# EAGLE design AM1027 POTS REV01 (EAGLE 6.6.0)
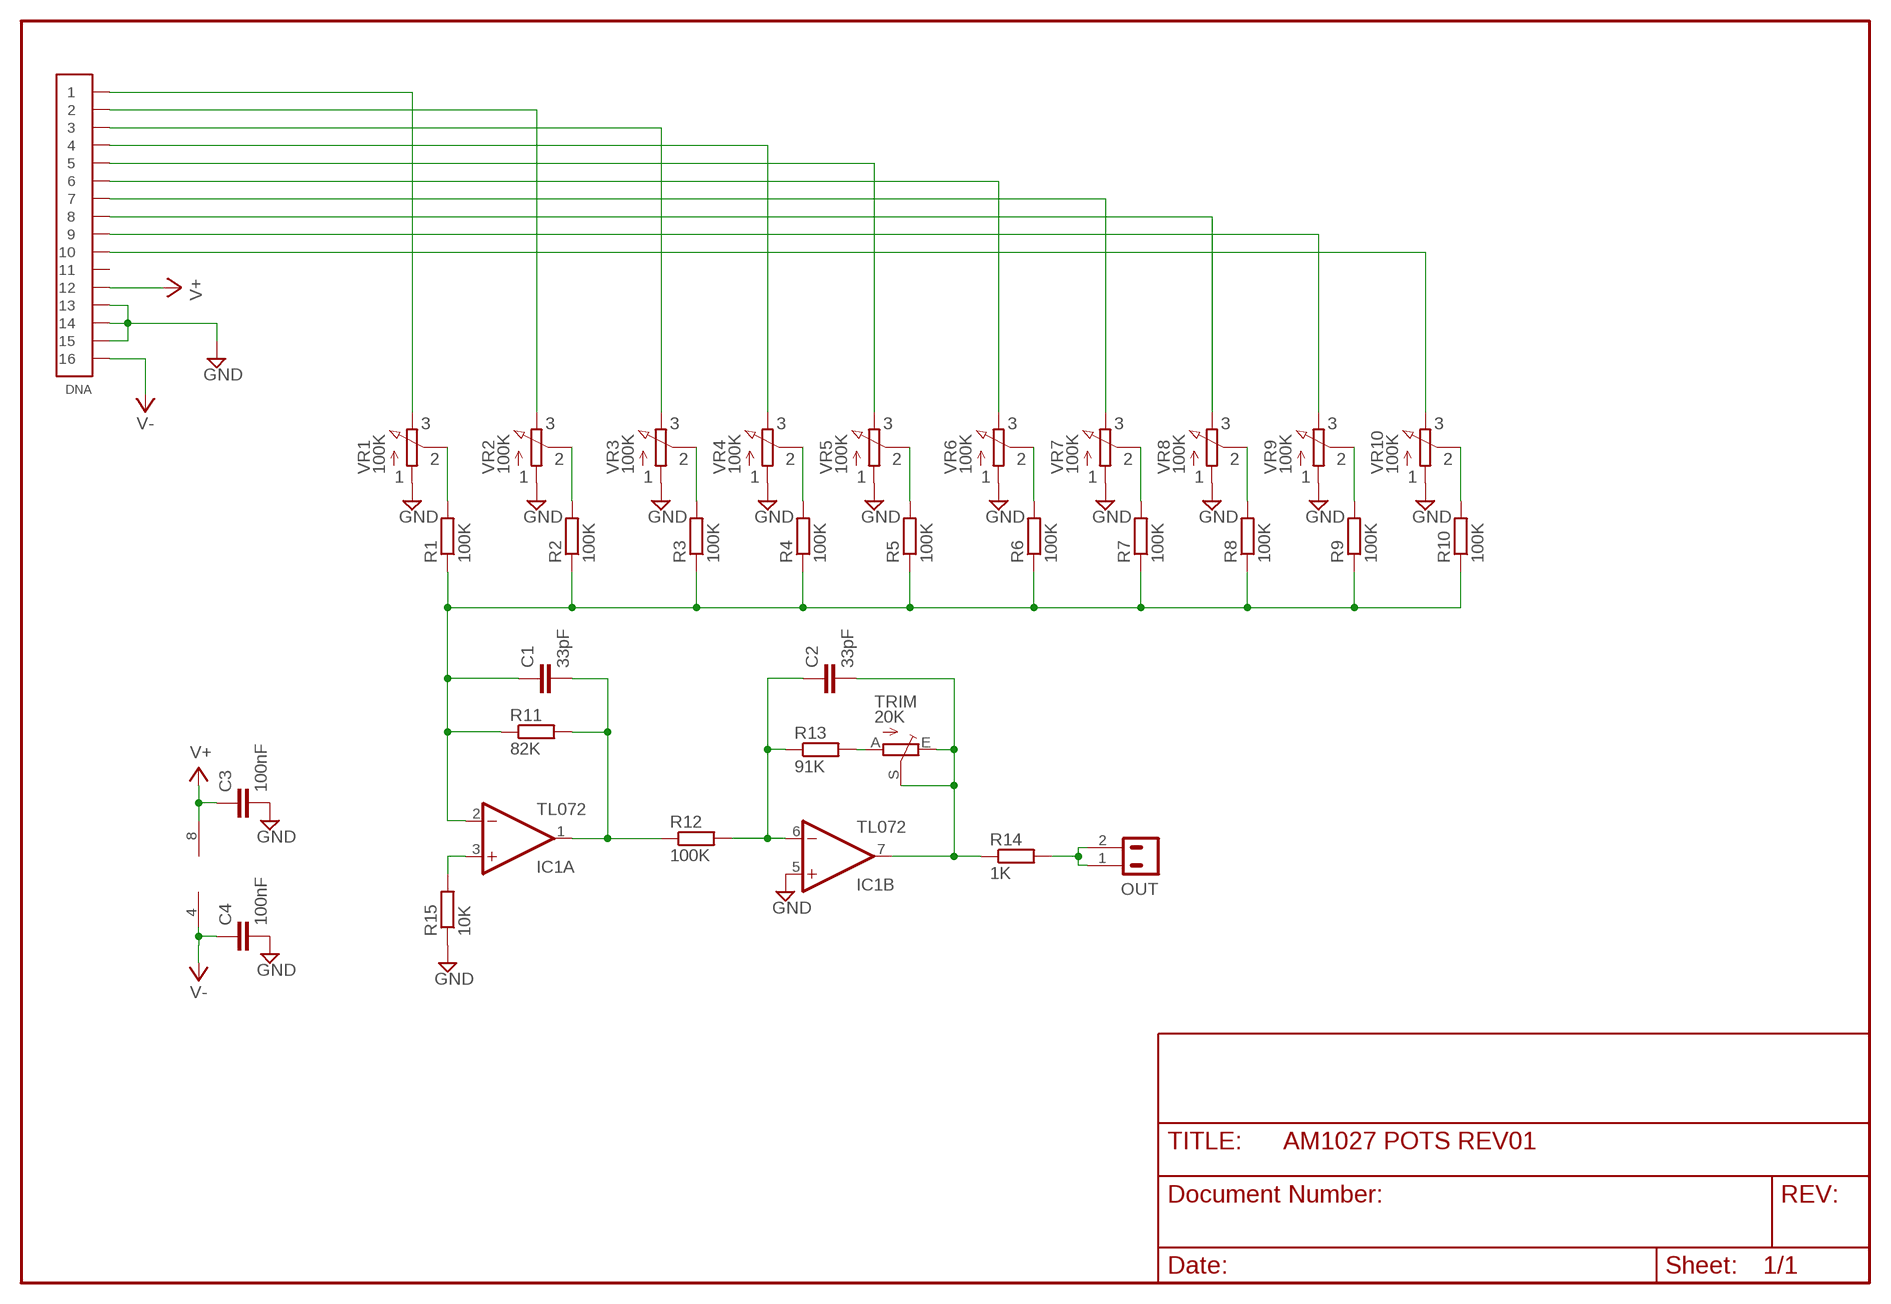
[diagram p0: schematic, sheet 1]

## Parts
C1  33pF  C-EU050-025X075AM  [C050-025X075AM]
C2  33pF  C-EU050-025X075AM  [C050-025X075AM]
C3  100nF  C-EU050-025X075AM  [C050-025X075AM]
C4  100nF  C-EU050-025X075AM  [C050-025X075AM]
DNA  AMPWR16PIN  [AMPWR16]
IC1  TL072  [DIL08AM]
OUT  MA02-AM  [MA02-AM]
R1  100K  R-EU_0207/10-AM  [0207/10/AM]
R2  100K  R-EU_0207/10-AM  [0207/10/AM]
R3  100K  R-EU_0207/10-AM  [0207/10/AM]
R4  100K  R-EU_0207/10-AM  [0207/10/AM]
R5  100K  R-EU_0207/10-AM  [0207/10/AM]
R6  100K  R-EU_0207/10-AM  [0207/10/AM]
R7  100K  R-EU_0207/10-AM  [0207/10/AM]
R8  100K  R-EU_0207/10-AM  [0207/10/AM]
R9  100K  R-EU_0207/10-AM  [0207/10/AM]
R10  100K  R-EU_0207/10-AM  [0207/10/AM]
R11  82K  R-EU_0207/10-AM  [0207/10/AM]
R12  100K  R-EU_0207/10-AM  [0207/10/AM]
R13  91K  R-EU_0207/10-AM  [0207/10/AM]
R14  1K  R-EU_0207/10-AM  [0207/10/AM]
R15  10K  R-EU_0207/10-AM  [0207/10/AM]
TRIM  20K  TRIM_EU-S64W  [S64W-AM]
VR1  100K  SPECTROL148  [SPECTROL148]
VR2  100K  SPECTROL148  [SPECTROL148]
VR3  100K  SPECTROL148  [SPECTROL148]
VR4  100K  SPECTROL148  [SPECTROL148]
VR5  100K  SPECTROL148  [SPECTROL148]
VR6  100K  SPECTROL148  [SPECTROL148]
VR7  100K  SPECTROL148  [SPECTROL148]
VR8  100K  SPECTROL148  [SPECTROL148]
VR9  100K  SPECTROL148  [SPECTROL148]
VR10  100K  SPECTROL148  [SPECTROL148]

## Nets
GND [POWER]: C3.P$4 C4.P$4 DNA.13 DNA.14 DNA.15 IC1.5(B:+IN) R15.P$1 VR1.P$1(A) VR2.P$1(A) VR3.P$1(A) VR4.P$1(A) VR5.P$1(A) VR6.P$1(A) VR7.P$1(A) VR8.P$1(A) VR9.P$1(A) VR10.P$1(A)
N$1: R1.P$2 VR1.P$2(S)
N$2: R2.P$2 VR2.P$2(S)
N$3: R3.P$2 VR3.P$2(S)
N$4: R4.P$2 VR4.P$2(S)
N$5: R5.P$2 VR5.P$2(S)
N$6: R6.P$2 VR6.P$2(S)
N$7: R7.P$2 VR7.P$2(S)
N$8: R8.P$2 VR8.P$2(S)
N$9: R9.P$2 VR9.P$2(S)
N$10: R10.P$2 VR10.P$2(S)
N$11: DNA.1 VR1.P$3(E)
N$12: DNA.2 VR2.P$3(E)
N$13: DNA.3 VR3.P$3(E)
N$14: DNA.4 VR4.P$3(E)
N$15: DNA.5 VR5.P$3(E)
N$16: DNA.6 VR6.P$3(E)
N$17: DNA.7 VR7.P$3(E)
N$18: DNA.8 VR8.P$3(E)
N$19: DNA.9 VR9.P$3(E)
N$20: DNA.10 VR10.P$3(E)
N$21: C1.P$3 IC1.2(A:-IN) R1.P$1 R2.P$1 R3.P$1 R4.P$1 R5.P$1 R6.P$1 R7.P$1 R8.P$1 R9.P$1 R10.P$1 R11.P$1
N$22: C2.P$4 IC1.7(B:OUT) R14.P$1 TRIM.E TRIM.S
N$23: C1.P$4 IC1.1(A:OUT) R11.P$2 R12.P$1
N$24: C2.P$3 IC1.6(B:-IN) R12.P$2 R13.P$1
N$25: IC1.3(A:+IN) R15.P$2
N$26: R13.P$2 TRIM.A
N$27: OUT.1 OUT.2 R14.P$2
V+ [POWER]: C3.P$3 DNA.12 IC1.8(P:V+)
V- [POWER]: C4.P$3 DNA.16 IC1.4(P:V-)
Unconnected: DNA.11

## Library data of the parts
C1-C4 = rcl:C-EU: CAPACITOR, European symbol
DNA = analog-metropolis:AMPWR16PIN: Doepfer 16 pin Power Supply Connector
IC1 = analog-metropolis:TL072: OP AMP
OUT = con-lstb:MA02-AM: 0.1" Pin Header - AM Style 1.0mm holes
R1-R15 = rcl:R-EU_: RESISTOR, European symbol
TRIM = pot:TRIM_EU-: POTENTIOMETER AM Style
VR1-VR10 = pot:SPECTROL148: SPECTROL 148 Potentiometer - AM style

## Net classes
0 default: width 0.381 mm, drill 0.7 mm, clearance 0.381 mm
1 POWER: width 0.635 mm, drill 0.7 mm, clearance 0.635 mm

## Board
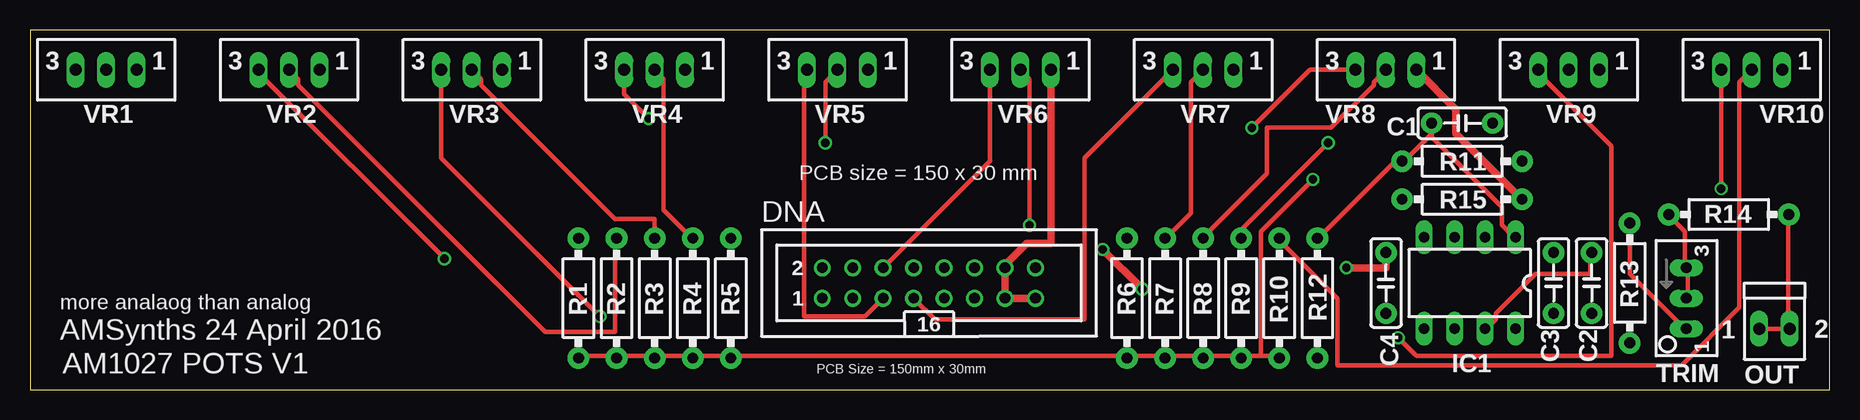
[diagram p1: board, top side]
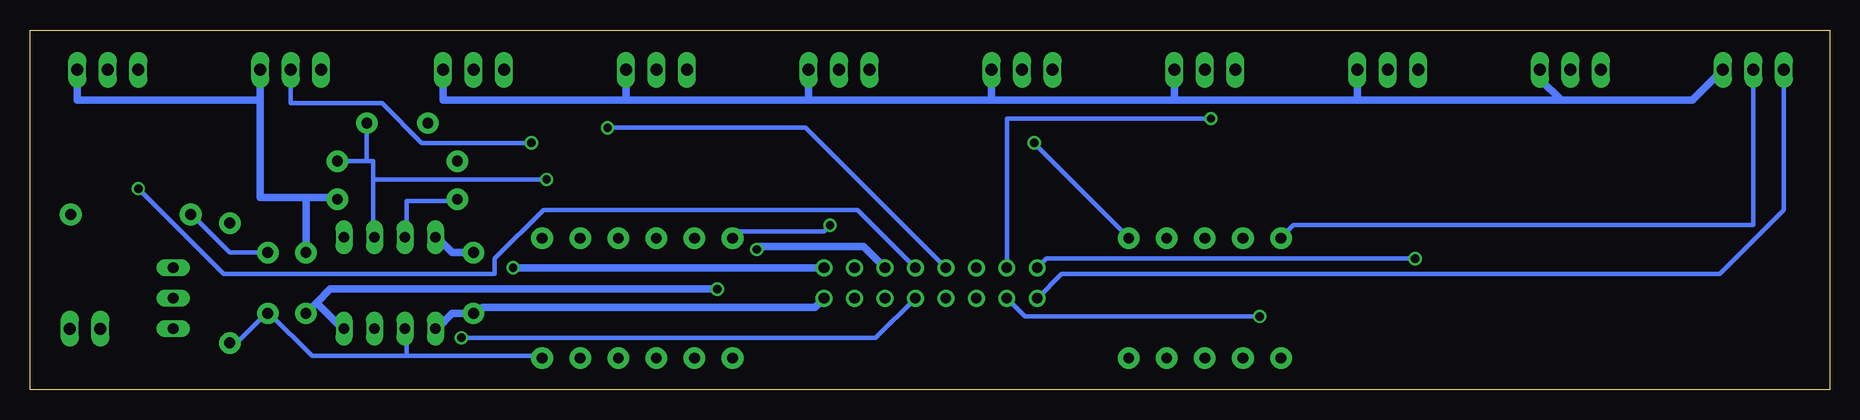
[diagram p2: board, bottom side, seen from below]

Size 150 x 30 mm. Coordinates in mm from the lower left corner, seen from the top.
Outline: 0,0 150,0 150,30 0,30 0,0
Copper layers (1*16): Top 0.035mm / dielectric 1.5mm / Bottom 0.035mm
Design rules "default": minimum track width 10mil, minimum drill 24mil, track to track 8mil, track to pad 8mil, pad to pad 8mil, via to via 8mil, smd to smd 8mil, copper to edge 40mil, drill to drill 8mil, minimum pad ring 10mil, minimum via ring 8mil, stop-mask expansion 4mil, vias tented up to drill 0mil, thermal gap 10mil

### Footprints (pad centres in the part's own frame; a part is rotated, then mirrored left to right if it is on the bottom)
C050-025X075AM = drill 0.9 pad 1.778: P$3 -2.54,0; P$4 2.54,0
AMPWR16 = drill 0.9: 1 -8.89,-1.27; 2 -8.89,1.27; 3 -6.35,-1.27; 4 -6.35,1.27; 5 -3.81,-1.27; 6 -3.81,1.27; 7 -1.27,-1.27; 8 -1.27,1.27; 9 1.27,-1.27; 10 1.27,1.27; 11 3.81,-1.27; 12 3.81,1.27; 13 6.35,-1.27; 14 6.35,1.27; 15 8.89,-1.27; 16 8.89,1.27
DIL08AM = drill 0.9 long: 1 -3.81,-3.81; 2 -1.27,-3.81; 3 1.27,-3.81; 4 3.81,-3.81; 5 3.81,3.81; 6 1.27,3.81; 7 -1.27,3.81; 8 -3.81,3.81
MA02-AM = drill 1 long: 1 -1.27,0; 2 1.27,0
0207/10/AM = drill 0.9 pad 1.8: P$1 -5,0; P$2 5,0
S64W-AM = drill 0.9 long: A 2.54,0.27; E -2.54,0.27; S 0,0.27
SPECTROL148 = drill 1 long: P$1 2.54,-2.54; P$2 0,-2.54; P$3 -2.54,-2.54

### Placement (x,y rotation side)
C1  119.38,22.23 180 top
C2  130.18,8.89 90 top
C3  127,8.89 90 top
C4  113.03,8.89 270 top
DNA  74.93,8.89 0 top
IC1  120.02,8.89 180 top
OUT  145.41,5.08 0 top
R1  45.72,7.62 90 top
R2  48.9,7.62 90 top
R3  52.07,7.62 90 top
R4  55.24,7.62 90 top
R5  58.42,7.62 90 top
R6  91.44,7.62 90 top
R7  94.61,7.62 90 top
R8  97.79,7.62 90 top
R9  100.97,7.62 90 top
R10  104.14,7.62 90 top
R11  119.38,19.05 180 top
R12  107.31,7.62 270 top
R13  133.35,8.89 90 top
R14  141.6,14.61 0 top
R15  119.38,15.88 180 top
TRIM  137.79,7.62 270 top
VR1  6.35,29.21 0 top
VR2  21.59,29.21 0 top
VR3  36.83,29.21 0 top
VR4  52.07,29.21 0 top
VR5  67.31,29.21 0 top
VR6  82.55,29.21 0 top
VR7  97.79,29.21 0 top
VR8  113.03,29.21 0 top
VR9  128.27,29.21 0 top
VR10  143.51,29.21 0 top

### Tracks (layer width: path | path; a pad name or v marks a point on that pad's centre or on a via)
GND
  Top 0.635: DNA.15 DNA.13 DNA.14 81.28,10.41 83.06,12.19 85.09,12.19 VR6.P$1 | VR8.P$1 118.87,23.37 118.87,21.34 124.21,16 R15.P$1
  Bottom 0.635: 130.81,24.13 130.81,16 127,16 | 130.81,24.13 VR9.P$1 | 127,16 124.46,16 R15.P$1 | VR10.P$1 146.05,24.13 130.81,24.13 | 127,16 C3.P$4 | IC1.5 116.08,5.08 114.81,6.35 C4.P$4 112.78,6.35 112.27,6.86 84.58,6.86 DNA.15 | VR1.P$1 11.43,24.13 22.35,24.13 | 22.35,24.13 24.13,25.91 VR2.P$1 | 39.37,24.13 VR3.P$1 | 22.35,24.13 39.37,24.13 | 54.61,24.13 VR4.P$1 | 39.37,24.13 54.61,24.13 | 69.85,24.13 VR5.P$1 | 54.61,24.13 69.85,24.13 | 85.09,24.13 VR6.P$1 | 69.85,24.13 85.09,24.13 | 100.33,24.13 VR7.P$1 | 85.09,24.13 100.33,24.13 | VR8.P$1 115.57,24.13 100.33,24.13
N$1
  Bottom 0.381: VR1.P$2 6.35,13.72 44.7,13.72 45.72,12.7 R1.P$2
N$2
  Top 0.381: VR2.P$2 22.35,25.91 22.35,25.4 42.93,4.83 48.77,4.83 48.77,12.45 R2.P$2
N$3
  Top 0.381: VR3.P$2 37.59,25.91 37.59,25.4 48.77,14.22 52.07,14.22 R3.P$2
N$4
  Top 0.381: VR4.P$2 52.83,25.91 52.83,14.99 55.12,12.7 R4.P$2
N$5  (via drill 0.7)
  Top 0.381: VR5.P$2 66.29,25.65 v66.29,20.57
  Bottom 0.381: v66.29,20.57 58.42,12.7 R5.P$2
N$6  (via drill 0.7)
  Top 0.381: VR6.P$2 83.31,25.91 v83.31,13.72
  Bottom 0.381: v83.31,13.72 83.82,13.21 90.93,13.21 91.44,12.7 R6.P$2
N$7
  Top 0.381: VR7.P$2 96.77,25.65 96.77,14.73 94.74,12.7 R7.P$2
N$8
  Top 0.381: VR8.P$2 112.01,25.65 112.01,25.4 108.46,21.84 103.12,21.84 103.12,18.03 97.79,12.7 R8.P$2
N$9  (via drill 0.7)
  Top 0.381: v108.2,20.57 101.09,13.46 101.09,12.7 R9.P$2
  Bottom 0.381: VR9.P$2 128.27,23.88 120.65,23.88 117.35,20.57 v108.2,20.57
N$10
  Top 0.381: VR10.P$2 142.49,25.65 142.49,6.86 137.67,2.03 108.97,2.03 108.97,7.62 104.14,12.45 R10.P$2
N$11
  Bottom 0.381: DNA.1 64.01,9.65 9.14,9.65 3.81,14.99 VR1.P$3
N$12  (via drill 0.7)
  Top 0.381: v34.54,10.92 19.05,26.42 VR2.P$3
  Bottom 0.381: DNA.2 65.28,10.92 v34.54,10.92
N$13  (via drill 0.7)
  Top 0.381: v47.5,6.1 34.29,19.3 VR3.P$3
  Bottom 0.381: DNA.3 67.06,6.1 v47.5,6.1
N$14  (via drill 0.7)
  Top 0.381: v51.56,22.61 49.53,24.64 VR4.P$3
  Bottom 0.381: DNA.4 68.58,22.61 v51.56,22.61
N$15
  Top 0.381: DNA.5 69.6,6.1 64.52,6.1 64.52,26.42 VR5.P$3
N$16
  Top 0.381: DNA.6 80.01,19.05 VR6.P$3
N$17
  Top 0.381: DNA.7 75.44,5.84 87.88,5.84 87.88,19.3 VR7.P$3
N$18  (via drill 0.7)
  Top 0.381: v101.85,21.84 106.68,26.67 VR8.P$3
  Bottom 0.381: DNA.8 85.34,21.84 v101.85,21.84
N$19  (via drill 0.7)
  Top 0.381: v114.05,4.32 115.57,2.79 131.83,2.79 131.83,20.32 125.73,26.42 VR9.P$3
  Bottom 0.381: DNA.9 79.5,4.32 v114.05,4.32
N$20  (via drill 0.7)
  Top 0.381: VR10.P$3 v140.97,16.76
  Bottom 0.381: DNA.10 81.03,14.99 107.19,14.99 111.25,10.92 111.25,9.65 133.86,9.65 v140.97,16.76
N$21  (via drill 0.7)
  Top 0.381: 58.42,2.79 55.37,2.79 R4.P$1 55.12,2.79 52.07,2.79 | R1.P$1 45.72,2.79 48.77,2.79 R2.P$1 49.02,2.79 52.07,2.79 | 52.07,2.79 R3.P$1 | 102.62,2.79 104.14,2.79 R10.P$1 | 102.62,2.79 101.09,2.79 R9.P$1 100.84,2.79 97.79,2.79 | 91.44,2.79 94.49,2.79 R7.P$1 94.74,2.79 97.79,2.79 | 97.79,2.79 R8.P$1 | v106.93,17.53 102.62,13.21 102.62,2.79 | 91.44,2.79 58.42,2.79 | 58.42,2.79 R5.P$1 | 91.44,2.79 R6.P$1
  Bottom 0.381: 121.41,17.53 121.41,19.05 121.92,19.05 | 121.41,17.53 121.41,12.7 IC1.2 | R11.P$1 121.92,19.05 | 121.92,19.05 C1.P$3 | v106.93,17.53 121.41,17.53
N$22
  Top 0.381: TRIM.S 138.18,7.62 138.18,10.16 TRIM.E 137.92,10.16 137.92,13.21 136.65,14.48 R14.P$1 | IC1.7 121.41,5.08 122.17,5.84 122.17,6.35 125.48,9.65 130.05,9.65 130.05,11.43 C2.P$4
  Bottom 0.381: C2.P$4 133.35,11.43 136.4,14.48 R14.P$1
N$23
  Top 0.381: R12.P$1 107.44,12.7 113.79,19.05 R11.P$2 114.55,19.05 116.84,21.34 | C1.P$4 116.84,21.34 | 116.84,21.34 116.84,21.08 122.68,15.24 122.68,13.72 123.7,12.7 IC1.1
N$24
  Bottom 0.381: R13.P$1 133.35,4.06 132.59,4.06 130.3,6.35 C2.P$3 130.05,6.35 126.49,2.79 118.62,2.79 | 118.62,2.79 118.62,5.08 IC1.6 | 118.62,2.79 107.44,2.79 R12.P$2
N$25
  Bottom 0.381: IC1.3 118.62,12.7 118.62,15.75 114.55,15.75 R15.P$2
N$26
  Top 0.381: R13.P$2 133.35,9.65 137.92,5.08 TRIM.A
N$27
  Top 0.381: 146.56,5.08 OUT.1 | 146.56,5.08 146.56,14.48 R14.P$2 | 146.56,5.08 OUT.2
V+  (via drill 0.7)
  Top 0.635: 123.95,5.08 IC1.8 | v92.71,8.38 v89.41,11.68
  Bottom 0.635: DNA.12 80.52,11.94 89.15,11.94 v89.41,11.68 | v92.71,8.38 124.97,8.38 126.11,7.24 | C3.P$3 126.11,7.24 | 126.11,7.24 123.95,5.08 IC1.8
V-  (via drill 0.7)
  Top 0.635: 116.33,12.7 IC1.4 | v109.73,10.16 113.03,10.16 C4.P$3
  Bottom 0.635: v109.73,10.16 DNA.16 | C4.P$3 114.81,11.43 116.08,12.7 IC1.4

### Text on the board
tNames: PCB size = 150 x 30 mm | more analaog than analog | AMSynths 24 April 2016 | AM1027 POTS V1 | PCB Size = 150mm x 30mm